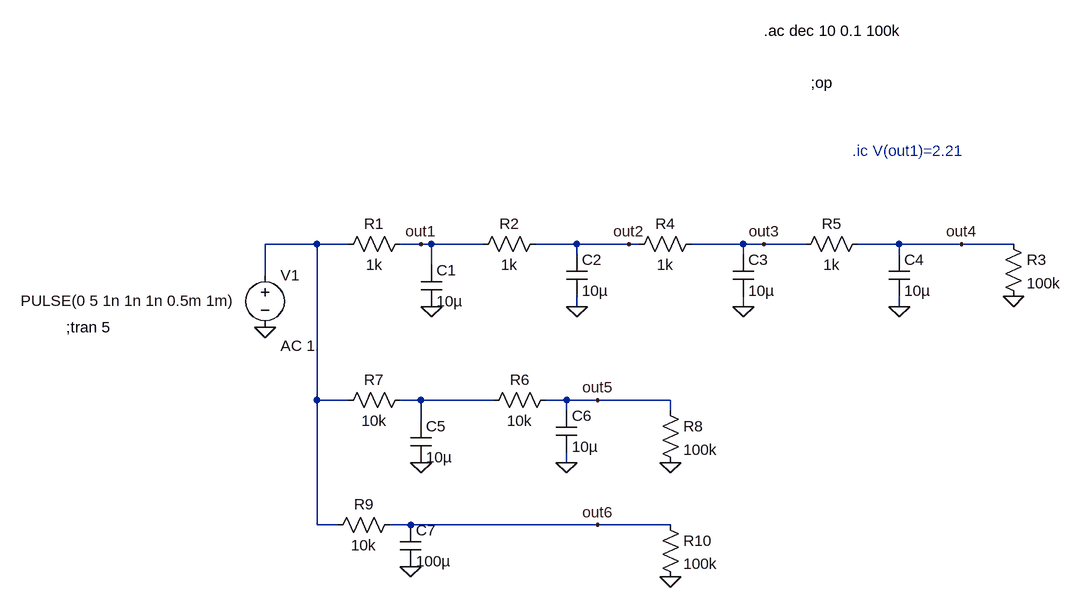
[diagram p0: schematic filter_comparison.asc]
filter_comparison.asc, the LTspice schematic file:
Version 4
SHEET 1 880 916
WIRE -656 64 -736 64
WIRE -608 64 -656 64
WIRE -496 64 -528 64
WIRE -480 64 -496 64
WIRE -400 64 -480 64
WIRE -256 64 -320 64
WIRE -176 64 -256 64
WIRE -160 64 -176 64
WIRE 0 64 -80 64
WIRE 32 64 0 64
WIRE 96 64 32 64
WIRE 240 64 176 64
WIRE 336 64 240 64
WIRE 416 64 336 64
WIRE -256 80 -256 64
WIRE 0 80 0 64
WIRE 240 80 240 64
WIRE -480 96 -480 64
WIRE -736 112 -736 64
WIRE -256 160 -256 144
WIRE 0 160 0 144
WIRE 240 160 240 144
WIRE -656 304 -656 64
WIRE -608 304 -656 304
WIRE -496 304 -528 304
WIRE -384 304 -496 304
WIRE -272 304 -304 304
WIRE -224 304 -272 304
WIRE -112 304 -224 304
WIRE -272 320 -272 304
WIRE -112 320 -112 304
WIRE -496 336 -496 304
WIRE -272 400 -272 384
WIRE -656 496 -656 304
WIRE -624 496 -656 496
WIRE -512 496 -544 496
WIRE -224 496 -512 496
WIRE -112 496 -224 496
FLAG -736 192 0
FLAG -480 160 0
FLAG -496 64 out1
FLAG -256 160 0
FLAG 416 144 0
FLAG -176 64 out2
FLAG 0 160 0
FLAG 240 160 0
FLAG 32 64 out3
FLAG 336 64 out4
FLAG -496 400 0
FLAG -272 400 0
FLAG -224 304 out5
FLAG -112 400 0
FLAG -512 560 0
FLAG -112 576 0
FLAG -224 496 out6
SYMBOL voltage -736 96 R0
WINDOW 3 -376 55 Left 2
WINDOW 123 24 124 Left 2
WINDOW 39 0 0 Left 0
SYMATTR InstName V1
SYMATTR Value PULSE(0 5 1n 1n 1n 0.5m 1m)
SYMATTR Value2 AC 1
SYMBOL res -512 48 R90
WINDOW 0 0 56 VBottom 2
WINDOW 3 32 56 VTop 2
SYMATTR InstName R1
SYMATTR Value 1k
SYMBOL cap -496 96 R0
SYMATTR InstName C1
SYMATTR Value 10µ
SYMBOL res -304 48 R90
WINDOW 0 0 56 VBottom 2
WINDOW 3 32 56 VTop 2
SYMATTR InstName R2
SYMATTR Value 1k
SYMBOL cap -272 80 R0
SYMATTR InstName C2
SYMATTR Value 10µ
SYMBOL res 400 48 R0
SYMATTR InstName R3
SYMATTR Value 100k
SYMBOL res -64 48 R90
WINDOW 0 0 56 VBottom 2
WINDOW 3 32 56 VTop 2
SYMATTR InstName R4
SYMATTR Value 1k
SYMBOL cap -16 80 R0
SYMATTR InstName C3
SYMATTR Value 10µ
SYMBOL res 192 48 R90
WINDOW 0 0 56 VBottom 2
WINDOW 3 32 56 VTop 2
SYMATTR InstName R5
SYMATTR Value 1k
SYMBOL cap 224 80 R0
SYMATTR InstName C4
SYMATTR Value 10µ
SYMBOL cap -512 336 R0
SYMATTR InstName C5
SYMATTR Value 10µ
SYMBOL res -288 288 R90
WINDOW 0 0 56 VBottom 2
WINDOW 3 32 56 VTop 2
SYMATTR InstName R6
SYMATTR Value 10k
SYMBOL cap -288 320 R0
SYMATTR InstName C6
SYMATTR Value 10µ
SYMBOL res -512 288 R90
WINDOW 0 0 56 VBottom 2
WINDOW 3 32 56 VTop 2
SYMATTR InstName R7
SYMATTR Value 10k
SYMBOL res -128 304 R0
SYMATTR InstName R8
SYMATTR Value 100k
SYMBOL res -528 480 R90
WINDOW 0 0 56 VBottom 2
WINDOW 3 32 56 VTop 2
SYMATTR InstName R9
SYMATTR Value 10k
SYMBOL cap -528 496 R0
SYMATTR InstName C7
SYMATTR Value 100µ
SYMBOL res -128 480 R0
SYMATTR InstName R10
SYMATTR Value 100k
TEXT -1042 192 Left 2 !;tran 5
TEXT 168 -80 Left 2 ;.ic V(out1)=2.21
TEXT 104 -184 Left 2 !;op
TEXT 32 -264 Left 2 !.ac dec 10 0.1 100k

The netlist it stands for:
* filter_comparison.asc
V1 N001 0 PULSE(0 5 1n 1n 1n 0.5m 1m) AC 1
R1 out1 N001 1k
C1 out1 0 10µ
R2 out2 out1 1k
C2 out2 0 10µ
R3 out4 0 100k
R4 out3 out2 1k
C3 out3 0 10µ
R5 out4 out3 1k
C4 out4 0 10µ
C5 N002 0 10µ
R6 out5 N002 10k
C6 out5 0 10µ
R7 N002 N001 10k
R8 out5 0 100k
R9 out6 N001 10k
C7 out6 0 100µ
R10 out6 0 100k
;tran 5
* .ic V(out1)=2.21
;op
.ac dec 10 0.1 100k
.backanno
.end